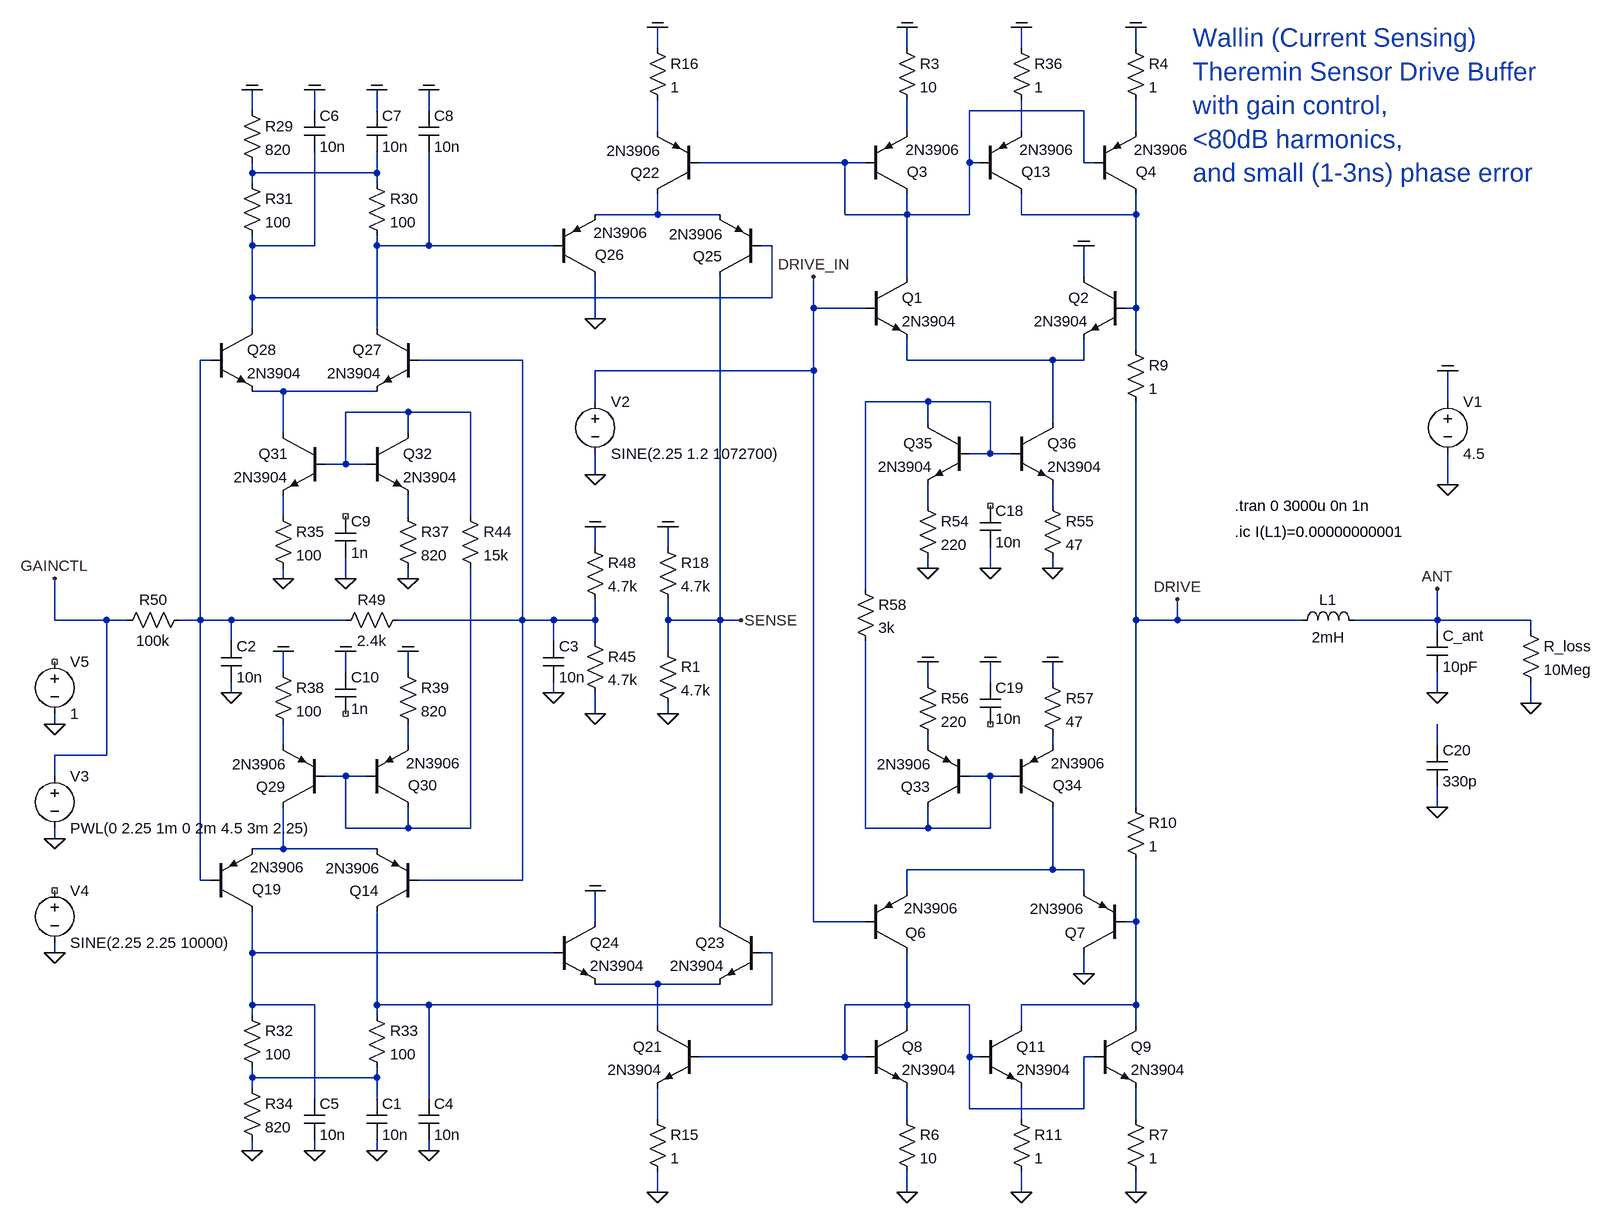
[diagram p0: schematic current_sensing_drive_buffer_v06.asc]
current_sensing_drive_buffer_v06.asc, the LTspice schematic file:
Version 4
SHEET 1 4504 7040
WIRE 928 2064 928 2032
WIRE 1312 2064 1312 2032
WIRE 1488 2064 1488 2032
WIRE 1664 2064 1664 2032
WIRE 304 2160 304 2128
WIRE 400 2160 400 2128
WIRE 496 2160 496 2128
WIRE 576 2160 576 2128
WIRE 1584 2160 1408 2160
WIRE 928 2192 928 2144
WIRE 1312 2192 1312 2144
WIRE 1488 2192 1488 2144
WIRE 1664 2192 1664 2144
WIRE 1216 2240 992 2240
WIRE 1248 2240 1216 2240
WIRE 1408 2240 1408 2160
WIRE 1424 2240 1408 2240
WIRE 1584 2240 1584 2160
WIRE 1600 2240 1584 2240
WIRE 304 2256 304 2240
WIRE 496 2256 496 2224
WIRE 496 2256 304 2256
WIRE 304 2272 304 2256
WIRE 496 2272 496 2256
WIRE 928 2320 928 2288
WIRE 928 2320 832 2320
WIRE 1024 2320 928 2320
WIRE 1216 2320 1216 2240
WIRE 1312 2320 1312 2288
WIRE 1312 2320 1216 2320
WIRE 1408 2320 1408 2240
WIRE 1408 2320 1312 2320
WIRE 1488 2320 1488 2288
WIRE 1664 2320 1664 2288
WIRE 1664 2320 1488 2320
WIRE 304 2368 304 2352
WIRE 400 2368 400 2224
WIRE 400 2368 304 2368
WIRE 496 2368 496 2352
WIRE 576 2368 576 2224
WIRE 576 2368 496 2368
WIRE 768 2368 576 2368
WIRE 1104 2368 1088 2368
WIRE 1312 2416 1312 2320
WIRE 1584 2416 1584 2368
WIRE 304 2448 304 2368
WIRE 1104 2448 1104 2368
WIRE 1104 2448 304 2448
WIRE 1168 2464 1168 2416
WIRE 1248 2464 1168 2464
WIRE 1664 2464 1664 2320
WIRE 1664 2464 1648 2464
WIRE 832 2480 832 2416
WIRE 304 2496 304 2448
WIRE 496 2496 496 2368
WIRE 1664 2528 1664 2464
WIRE 240 2544 224 2544
WIRE 720 2544 560 2544
WIRE 1312 2544 1312 2512
WIRE 1536 2544 1312 2544
WIRE 1584 2544 1584 2512
WIRE 1584 2544 1536 2544
WIRE 1168 2560 1168 2464
WIRE 1168 2560 832 2560
WIRE 352 2592 304 2592
WIRE 496 2592 352 2592
WIRE 832 2608 832 2560
WIRE 1344 2608 1248 2608
WIRE 1440 2608 1344 2608
WIRE 2144 2608 2144 2560
WIRE 544 2624 448 2624
WIRE 640 2624 544 2624
WIRE 1344 2640 1344 2608
WIRE 1536 2640 1536 2544
WIRE 352 2656 352 2592
WIRE 544 2656 544 2624
WIRE 1440 2688 1440 2608
WIRE 1440 2688 1408 2688
WIRE 1472 2688 1440 2688
WIRE 448 2704 448 2624
WIRE 448 2704 416 2704
WIRE 480 2704 448 2704
WIRE 832 2720 832 2688
WIRE 2144 2736 2144 2688
WIRE 1344 2768 1344 2736
WIRE 1536 2768 1536 2736
WIRE 352 2784 352 2752
WIRE 544 2784 544 2752
WIRE 640 2784 640 2624
WIRE 832 2832 832 2800
WIRE 944 2832 944 2800
WIRE 1344 2864 1344 2848
WIRE 1440 2864 1440 2832
WIRE 1536 2864 1536 2848
WIRE 352 2880 352 2864
WIRE 448 2880 448 2848
WIRE 544 2880 544 2864
WIRE 1248 2896 1248 2608
WIRE 0 2944 0 2880
WIRE 80 2944 0 2944
WIRE 112 2944 80 2944
WIRE 224 2944 224 2544
WIRE 224 2944 192 2944
WIRE 272 2944 224 2944
WIRE 448 2944 272 2944
WIRE 720 2944 720 2544
WIRE 720 2944 528 2944
WIRE 768 2944 720 2944
WIRE 832 2944 832 2912
WIRE 832 2944 768 2944
WIRE 944 2944 944 2912
WIRE 1024 2944 1024 2416
WIRE 1024 2944 944 2944
WIRE 1056 2944 1024 2944
WIRE 1664 2944 1664 2608
WIRE 1728 2944 1728 2912
WIRE 1728 2944 1664 2944
WIRE 1920 2944 1728 2944
WIRE 2128 2944 2128 2896
WIRE 2128 2944 2000 2944
WIRE 2272 2944 2128 2944
WIRE 2128 2960 2128 2944
WIRE 2272 2960 2272 2944
WIRE 272 2976 272 2944
WIRE 768 2976 768 2944
WIRE 832 2976 832 2944
WIRE 944 2992 944 2944
WIRE 352 3024 352 2992
WIRE 448 3024 448 2992
WIRE 544 3024 544 2992
WIRE 1344 3040 1344 3008
WIRE 1440 3040 1440 3008
WIRE 1536 3040 1536 3008
WIRE 272 3056 272 3040
WIRE 768 3056 768 3040
WIRE 2128 3056 2128 3024
WIRE 2272 3072 2272 3040
WIRE 832 3088 832 3056
WIRE 944 3088 944 3072
WIRE 0 3104 0 3088
WIRE 352 3136 352 3104
WIRE 544 3136 544 3104
WIRE 1344 3136 1344 3120
WIRE 1536 3136 1536 3120
WIRE 2128 3136 2128 3104
WIRE 80 3152 80 2944
WIRE 80 3152 0 3152
WIRE 0 3184 0 3152
WIRE 448 3184 416 3184
WIRE 480 3184 448 3184
WIRE 1440 3184 1408 3184
WIRE 1472 3184 1440 3184
WIRE 1664 3232 1664 2944
WIRE 2128 3232 2128 3200
WIRE 448 3264 448 3184
WIRE 544 3264 544 3232
WIRE 544 3264 448 3264
WIRE 640 3264 640 2864
WIRE 640 3264 544 3264
WIRE 1248 3264 1248 2976
WIRE 1344 3264 1344 3232
WIRE 1344 3264 1248 3264
WIRE 1440 3264 1440 3184
WIRE 1440 3264 1344 3264
WIRE 0 3280 0 3264
WIRE 352 3296 352 3232
WIRE 352 3296 304 3296
WIRE 496 3296 352 3296
WIRE 1536 3328 1536 3232
WIRE 1536 3328 1312 3328
WIRE 1584 3328 1536 3328
WIRE 224 3344 224 2944
WIRE 240 3344 224 3344
WIRE 720 3344 720 2944
WIRE 720 3344 560 3344
WIRE 1312 3360 1312 3328
WIRE 1584 3360 1584 3328
WIRE 832 3408 832 3360
WIRE 1024 3408 1024 2944
WIRE 1168 3408 1168 2560
WIRE 1248 3408 1168 3408
WIRE 1664 3408 1664 3312
WIRE 1664 3408 1648 3408
WIRE 0 3456 0 3440
WIRE 304 3456 304 3392
WIRE 768 3456 304 3456
WIRE 1104 3456 1088 3456
WIRE 1584 3488 1584 3456
WIRE 928 3504 832 3504
WIRE 1024 3504 928 3504
WIRE 304 3536 304 3456
WIRE 400 3536 304 3536
WIRE 496 3536 496 3392
WIRE 576 3536 496 3536
WIRE 1104 3536 1104 3456
WIRE 1104 3536 576 3536
WIRE 1312 3536 1312 3456
WIRE 1312 3536 1216 3536
WIRE 1408 3536 1312 3536
WIRE 1664 3536 1664 3408
WIRE 1664 3536 1488 3536
WIRE 304 3552 304 3536
WIRE 496 3552 496 3536
WIRE 928 3568 928 3504
WIRE 1312 3568 1312 3536
WIRE 1488 3568 1488 3536
WIRE 1664 3568 1664 3536
WIRE 1216 3616 1216 3536
WIRE 1216 3616 992 3616
WIRE 1248 3616 1216 3616
WIRE 1408 3616 1408 3536
WIRE 1424 3616 1408 3616
WIRE 1600 3616 1584 3616
WIRE 304 3648 304 3632
WIRE 496 3648 496 3632
WIRE 496 3648 304 3648
WIRE 304 3664 304 3648
WIRE 400 3680 400 3536
WIRE 496 3680 496 3648
WIRE 576 3680 576 3536
WIRE 1408 3696 1408 3616
WIRE 1584 3696 1584 3616
WIRE 1584 3696 1408 3696
WIRE 928 3712 928 3664
WIRE 1312 3712 1312 3664
WIRE 1488 3712 1488 3664
WIRE 1664 3712 1664 3664
WIRE 304 3760 304 3744
WIRE 400 3760 400 3744
WIRE 496 3760 496 3744
WIRE 576 3760 576 3744
WIRE 928 3824 928 3792
WIRE 1312 3824 1312 3792
WIRE 1488 3824 1488 3792
WIRE 1664 3824 1664 3792
FLAG 2144 2736 0
FLAG 2144 2560 COM
FLAG 1312 2032 COM
FLAG 1664 2032 COM
FLAG 1584 2368 COM
FLAG 832 2720 0
FLAG 1312 3824 0
FLAG 1664 3824 0
FLAG 1584 3488 0
FLAG 2128 3056 0
FLAG 2128 2896 ANT
FLAG 1728 2912 DRIVE
FLAG 2272 3072 0
FLAG 1168 2416 DRIVE_IN
FLAG 0 3280 0
FLAG 0 2880 GAINCTL
FLAG 0 3456 0
FLAG 0 3104 0
FLAG 1488 3824 0
FLAG 1488 2032 COM
FLAG 1344 3008 COM
FLAG 1536 3008 COM
FLAG 1344 2864 0
FLAG 1536 2864 0
FLAG 1440 2864 0
FLAG 1440 3008 COM
FLAG 2128 3232 0
FLAG 928 3824 0
FLAG 928 2032 COM
FLAG 832 2480 0
FLAG 832 3360 COM
FLAG 304 2128 COM
FLAG 304 3760 0
FLAG 496 3760 0
FLAG 576 3760 0
FLAG 400 3760 0
FLAG 400 2128 COM
FLAG 496 2128 COM
FLAG 576 2128 COM
FLAG 352 2992 COM
FLAG 544 2992 COM
FLAG 352 2880 0
FLAG 544 2880 0
FLAG 448 2880 0
FLAG 448 2992 COM
FLAG 832 3088 0
FLAG 832 2800 COM
FLAG 272 3056 0
FLAG 768 3056 0
FLAG 944 3088 0
FLAG 944 2800 COM
FLAG 1056 2944 SENSE
SYMBOL voltage 2144 2592 R0
SYMATTR InstName V1
SYMATTR Value 4.5
SYMBOL npn 1648 2416 M0
SYMATTR InstName Q2
SYMATTR Value 2N3904
SYMBOL npn 1248 2416 R0
SYMATTR InstName Q1
SYMATTR Value 2N3904
SYMBOL Res 1296 2048 R0
SYMATTR InstName R3
SYMATTR Value 10
SYMBOL pnp 1600 2288 M180
WINDOW 0 64 34 Left 2
WINDOW 3 61 68 Left 2
SYMATTR InstName Q4
SYMATTR Value 2N3906
SYMBOL Res 1648 2048 R0
SYMATTR InstName R4
SYMATTR Value 1
SYMBOL Voltage 832 2592 R0
SYMATTR InstName V2
SYMATTR Value SINE(2.25 1.2 1072700)
SYMBOL npn 1600 3568 R0
SYMATTR InstName Q9
SYMATTR Value 2N3904
SYMBOL Res 1296 3696 R0
SYMATTR InstName R6
SYMATTR Value 10
SYMBOL Res 1648 3696 R0
SYMATTR InstName R7
SYMATTR Value 1
SYMBOL pnp 1648 3456 R180
WINDOW 0 61 31 Left 2
WINDOW 3 62 68 Left 2
SYMATTR InstName Q7
SYMATTR Value 2N3906
SYMBOL pnp 1248 3456 M180
WINDOW 0 61 31 Left 2
WINDOW 3 59 69 Left 2
SYMATTR InstName Q6
SYMATTR Value 2N3906
SYMBOL Res 1648 3216 R0
SYMATTR InstName R10
SYMATTR Value 1
SYMBOL Res 1648 2512 R0
SYMATTR InstName R9
SYMATTR Value 1
SYMBOL ind 1904 2960 R270
WINDOW 0 32 56 VTop 2
WINDOW 3 5 56 VBottom 2
SYMATTR InstName L1
SYMATTR Value 2mH
SYMATTR SpiceLine Rser=120 Cpar=1pF
SYMBOL Cap 2112 2960 R0
SYMATTR InstName C_ant
SYMATTR Value 10pF
SYMBOL Res 2256 2944 R0
SYMATTR InstName R_loss
SYMATTR Value 10Meg
SYMBOL Voltage 0 3168 R0
SYMATTR InstName V3
SYMATTR Value PWL(0 2.25 1m 0 2m 4.5 3m 2.25)
SYMBOL Voltage 0 3344 R0
SYMATTR InstName V4
SYMATTR Value SINE(2.25 2.25 10000)
SYMBOL Voltage 0 2992 R0
SYMATTR InstName V5
SYMATTR Value 1
SYMBOL npn 1424 3568 R0
SYMATTR InstName Q11
SYMATTR Value 2N3904
SYMBOL Res 1472 3696 R0
SYMATTR InstName R11
SYMATTR Value 1
SYMBOL pnp 1424 2288 M180
WINDOW 0 64 34 Left 2
WINDOW 3 61 68 Left 2
SYMATTR InstName Q13
SYMATTR Value 2N3906
SYMBOL Res 1472 2048 R0
SYMATTR InstName R36
SYMATTR Value 1
SYMBOL npn 1248 3568 R0
SYMATTR InstName Q8
SYMATTR Value 2N3904
SYMBOL pnp 1248 2288 M180
WINDOW 0 64 34 Left 2
WINDOW 3 61 68 Left 2
SYMATTR InstName Q3
SYMATTR Value 2N3906
SYMBOL pnp 1408 3232 R180
WINDOW 0 60 32 Left 2
WINDOW 3 58 66 Left 2
SYMATTR InstName Q33
SYMATTR Value 2N3906
SYMBOL pnp 1472 3232 M180
WINDOW 0 64 34 Left 2
WINDOW 3 61 68 Left 2
SYMATTR InstName Q34
SYMATTR Value 2N3906
SYMBOL npn 1408 2640 M0
SYMATTR InstName Q35
SYMATTR Value 2N3904
SYMBOL npn 1472 2640 R0
SYMATTR InstName Q36
SYMATTR Value 2N3904
SYMBOL Res 1328 2752 R0
SYMATTR InstName R54
SYMATTR Value 220
SYMBOL Res 1520 2752 R0
SYMATTR InstName R55
SYMATTR Value 47
SYMBOL Res 1328 3024 R0
SYMATTR InstName R56
SYMATTR Value 220
SYMBOL Res 1520 3024 R0
SYMATTR InstName R57
SYMATTR Value 47
SYMBOL Res 1232 2880 R0
SYMATTR InstName R58
SYMATTR Value 3k
SYMBOL Cap 1424 2768 R0
SYMATTR InstName C18
SYMATTR Value 10n
SYMBOL Cap 1424 3040 R0
SYMATTR InstName C19
SYMATTR Value 10n
SYMBOL Cap 2112 3136 R0
SYMATTR InstName C20
SYMATTR Value 330p
SYMBOL pnp 560 3392 R180
WINDOW 0 60 32 Left 2
WINDOW 3 58 66 Left 2
SYMATTR InstName Q14
SYMATTR Value 2N3906
SYMBOL pnp 240 3392 M180
WINDOW 0 64 34 Left 2
WINDOW 3 61 68 Left 2
SYMATTR InstName Q19
SYMATTR Value 2N3906
SYMBOL npn 992 3568 M0
SYMATTR InstName Q21
SYMATTR Value 2N3904
SYMBOL Res 912 3696 R0
SYMATTR InstName R15
SYMATTR Value 1
SYMBOL pnp 992 2288 R180
WINDOW 0 60 32 Left 2
WINDOW 3 58 66 Left 2
SYMATTR InstName Q22
SYMATTR Value 2N3906
SYMBOL Res 912 2048 R0
SYMATTR InstName R16
SYMATTR Value 1
SYMBOL npn 1088 3408 M0
SYMATTR InstName Q23
SYMATTR Value 2N3904
SYMBOL npn 768 3408 R0
SYMATTR InstName Q24
SYMATTR Value 2N3904
SYMBOL pnp 1088 2416 R180
WINDOW 0 60 32 Left 2
WINDOW 3 58 66 Left 2
SYMATTR InstName Q25
SYMATTR Value 2N3906
SYMBOL pnp 768 2416 M180
WINDOW 0 64 34 Left 2
WINDOW 3 61 68 Left 2
SYMATTR InstName Q26
SYMATTR Value 2N3906
SYMBOL npn 560 2496 M0
SYMATTR InstName Q27
SYMATTR Value 2N3904
SYMBOL npn 240 2496 R0
SYMATTR InstName Q28
SYMATTR Value 2N3904
SYMBOL Res 288 2144 R0
SYMATTR InstName R29
SYMATTR Value 820
SYMBOL Res 480 2256 R0
SYMATTR InstName R30
SYMATTR Value 100
SYMBOL Res 288 2256 R0
SYMATTR InstName R31
SYMATTR Value 100
SYMBOL Res 288 3536 R0
SYMATTR InstName R32
SYMATTR Value 100
SYMBOL Res 480 3536 R0
SYMATTR InstName R33
SYMATTR Value 100
SYMBOL Res 288 3648 R0
SYMATTR InstName R34
SYMATTR Value 820
SYMBOL Cap 480 3680 R0
SYMATTR InstName C1
SYMATTR Value 10n
SYMBOL Cap 560 3680 R0
SYMATTR InstName C4
SYMATTR Value 10n
SYMBOL Cap 384 3680 R0
SYMATTR InstName C5
SYMATTR Value 10n
SYMBOL Cap 384 2160 R0
SYMATTR InstName C6
SYMATTR Value 10n
SYMBOL Cap 480 2160 R0
SYMATTR InstName C7
SYMATTR Value 10n
SYMBOL Cap 560 2160 R0
SYMATTR InstName C8
SYMATTR Value 10n
SYMBOL pnp 416 3232 R180
WINDOW 0 60 32 Left 2
WINDOW 3 58 66 Left 2
SYMATTR InstName Q29
SYMATTR Value 2N3906
SYMBOL pnp 480 3232 M180
WINDOW 0 64 34 Left 2
WINDOW 3 61 68 Left 2
SYMATTR InstName Q30
SYMATTR Value 2N3906
SYMBOL npn 416 2656 M0
SYMATTR InstName Q31
SYMATTR Value 2N3904
SYMBOL npn 480 2656 R0
SYMATTR InstName Q32
SYMATTR Value 2N3904
SYMBOL Res 336 2768 R0
SYMATTR InstName R35
SYMATTR Value 100
SYMBOL Res 528 2768 R0
SYMATTR InstName R37
SYMATTR Value 820
SYMBOL Res 336 3008 R0
SYMATTR InstName R38
SYMATTR Value 100
SYMBOL Res 528 3008 R0
SYMATTR InstName R39
SYMATTR Value 820
SYMBOL Res 624 2768 R0
SYMATTR InstName R44
SYMATTR Value 15k
SYMBOL Cap 432 2784 R0
SYMATTR InstName C9
SYMATTR Value 1n
SYMBOL Cap 432 3024 R0
SYMATTR InstName C10
SYMATTR Value 1n
SYMBOL Res 816 2960 R0
SYMATTR InstName R45
SYMATTR Value 4.7k
SYMBOL Res 816 2816 R0
SYMATTR InstName R48
SYMATTR Value 4.7k
SYMBOL Res 544 2928 R90
WINDOW 0 0 56 VBottom 2
WINDOW 3 32 56 VTop 2
SYMATTR InstName R49
SYMATTR Value 2.4k
SYMBOL Res 208 2928 R90
WINDOW 0 0 56 VBottom 2
WINDOW 3 32 56 VTop 2
SYMATTR InstName R50
SYMATTR Value 100k
SYMBOL Cap 256 2976 R0
SYMATTR InstName C2
SYMATTR Value 10n
SYMBOL Cap 752 2976 R0
SYMATTR InstName C3
SYMATTR Value 10n
SYMBOL Res 928 2976 R0
SYMATTR InstName R1
SYMATTR Value 4.7k
SYMBOL Res 928 2816 R0
SYMATTR InstName R18
SYMATTR Value 4.7k
TEXT 1816 2768 Left 2 !.tran 0 3000u 0n 1n
TEXT 1816 2808 Left 2 !.ic I(L1)=0.00000000001
TEXT 1752 2048 Left 4 ;Wallin (Current Sensing) \nTheremin Sensor Drive Buffer\nwith gain control, \n<80dB harmonics,\nand small (1-3ns) phase error

The netlist it stands for:
* current_sensing_drive_buffer_v06.asc
V1 COM 0 4.5
Q2 COM N008 N013 0 2N3904
Q1 N001 DRIVE_IN N013 0 2N3904
R3 COM N003 10
Q4 N008 N001 N005 0 2N3906
R4 COM N005 1
V2 DRIVE_IN 0 SINE(2.25 1.2 1072700)
Q9 N030 N034 N039 0 2N3904
R6 N037 0 10
R7 N039 0 1
Q7 0 N030 N029 0 2N3906
Q6 N034 DRIVE_IN N029 0 2N3906
R10 DRIVE N030 1
R9 N008 DRIVE 1
L1 DRIVE ANT 2mH Rser=120 Cpar=1pF
C_ant ANT 0 10pF
R_loss ANT 0 10Meg
V3 GAINCTL 0 PWL(0 2.25 1m 0 2m 4.5 3m 2.25)
V4 NC_01 0 SINE(2.25 2.25 10000)
V5 NC_02 0 1
Q11 N030 N034 N038 0 2N3904
R11 N038 0 1
Q13 N008 N001 N004 0 2N3906
R36 COM N004 1
Q8 N034 N034 N037 0 2N3904
Q3 N001 N001 N003 0 2N3906
Q33 N027 N027 N023 0 2N3906
Q34 N029 N027 N024 0 2N3906
Q35 N015 N015 N017 0 2N3904
Q36 N013 N015 N018 0 2N3904
R54 N017 0 220
R55 N018 0 47
R56 COM N023 220
R57 COM N024 47
R58 N015 N027 3k
C18 NC_03 0 10n
C19 COM NC_04 10n
C20 N025 0 330p
Q14 N032 N012 N028 0 2N3906
Q19 N031 N011 N028 0 2N3906
Q21 N033 N034 N036 0 2N3904
R15 N036 0 1
Q22 N007 N001 N002 0 2N3906
R16 COM N002 1
Q23 SENSE N032 N033 0 2N3904
Q24 COM N031 N033 0 2N3904
Q25 SENSE N009 N007 0 2N3906
Q26 0 N010 N007 0 2N3906
Q27 N010 N012 N014 0 2N3904
Q28 N009 N011 N014 0 2N3904
R29 COM N006 820
R30 N006 N010 100
R31 N006 N009 100
R32 N031 N035 100
R33 N032 N035 100
R34 N035 0 820
C1 N035 0 10n
C4 N032 0 10n
C5 N031 0 10n
C6 COM N009 10n
C7 COM N006 10n
C8 COM N010 10n
Q29 N028 N026 N021 0 2N3906
Q30 N026 N026 N022 0 2N3906
Q31 N014 N016 N019 0 2N3904
Q32 N016 N016 N020 0 2N3904
R35 N019 0 100
R37 N020 0 820
R38 COM N021 100
R39 COM N022 820
R44 N016 N026 15k
C9 NC_05 0 1n
C10 COM NC_06 1n
R45 N012 0 4.7k
R48 COM N012 4.7k
R49 N012 N011 2.4k
R50 N011 GAINCTL 100k
C2 N011 0 10n
C3 N012 0 10n
R1 SENSE 0 4.7k
R18 COM SENSE 4.7k
.model NPN NPN
.model PNP PNP
.lib standard.bjt
.tran 0 3000u 0n 1n
.ic I(L1)=0.00000000001
* Wallin (Current Sensing)
* Theremin Sensor Drive Buffer
* with gain control,
* <80dB harmonics,
* and small (1-3ns) phase error
.backanno
.end